# Altium schematic sheet REACTION-CIRCUIT-CONTROL.SchDoc
size A4
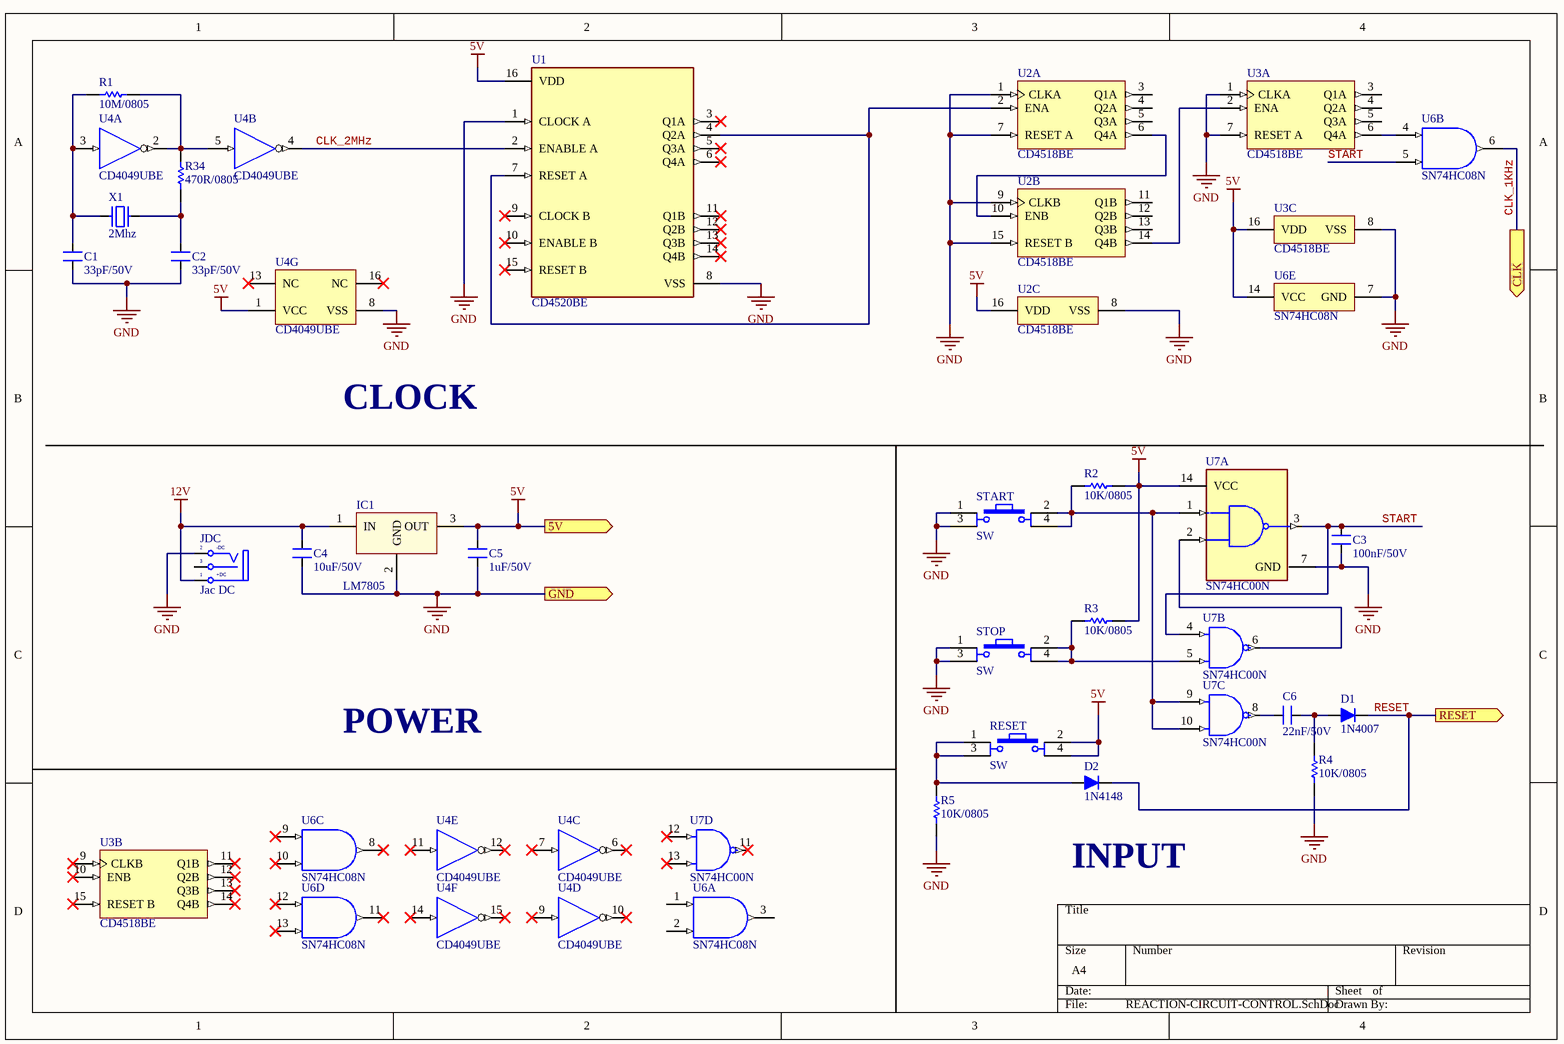
[diagram p0: REACTION-CIRCUIT-CONTROL.SchDoc]

## Parts
C1  33pF/50V  [Cap 0805(2012)]
C2  33pF/50V  [Cap 0805(2012)]
C3  100nF/50V  [Cap 0805(2012)]
C4  10uF/50V  [Cap 0805(2012)]
C5  1uF/50V  [Cap 0805(2012)]
C6  22nF/50V  [Cap 0805(2012)]
D1  1N4007  [1N4007]
D2  1N4148  [1N4007]
IC1  LM7805  [QTO-220H3]
JDC  Jac DC  [DC-IN]
R1  10M/0805  [Res 0805(2012)]
R2  10K/0805  [Res 0805(2012)]
R3  10K/0805  [Res 0805(2012)]
R4  10K/0805  [Res 0805(2012)]
R5  10K/0805  [Res 0805(2012)]
R34  470R/0805  [Res 0805(2012)]
RESET  SW  [SW4B]
START  SW  [SW4B]
STOP  SW  [SW4B]
U1  CD4520BE  [FP-N0016A-MFG]
U2  CD4518BE  [N0016A]  (parts A,B,C of 3)
U3  CD4518BE  [N0016A]  (parts A,B,C of 3)
U4  CD4049UBE  [N0016A]  (parts A,B,C,D,E,F,G of 7)
U6  SN74HC08N  [N0014A]  (parts A,B,C,D,E of 5)
U7  SN74HC00N  [FP-N0014A-MFG]  (parts A,B,C,D of 4)
X1  2Mhz  [XT2]

## Ports
5V (out), CLK (out), GND (out), RESET (out)

## Nets
5V: C5.2 IC1.3(OUT) R2.2 R3.2 RESET.2 RESET.4 U1.16(VDD) U2.16(VDD) U3.16(VDD) U4.1(VCC) U6.14(VCC) U7.14(VCC) ; port 5V
12V: C4.2 IC1.1(IN) JDC.1(T)
GND: C1.1 C2.1 C3.1 C4.1 C5.1 IC1.2(GND) JDC.2(TN) R4.2 R5.2 START.1 START.3 STOP.1 STOP.3 U1.1(CLOCK_A) U1.8(VSS) U2.1(CLKA) U2.7(RESET_A) U2.8(VSS) U2.9(CLKB) U2.15(RESET_B) U3.1(CLKA) U3.7(RESET_A) U3.8(VSS) U4.8(VSS) U6.7(GND) U7.7(GND) ; port GND
CLK_1KHz: U6.6(2Y) ; port CLK
CLK_2MHz: U1.2(ENABLE_A) U4.4(H=~{B})
RESET: D1.2(K) D2.2(K) ; port RESET
START: C3.2 U6.5(2B) U7.3(1Y) U7.4(2A)
NetC1_2: C1.2 R1.2 U4.3(A) X1.1
NetC2_2: C2.2 R34.2 X1.2
NetC6_1: C6.1 D1.1(A) R4.1
NetC6_2: C6.2 U7.8(3Y)
NetD2_1: D2.1(A) R5.1 RESET.1 RESET.3
NetR1_1: R1.1 R34.1 U4.2(G=~{A}) U4.5(B)
NetR2_1: R2.1 START.2 START.4 U7.1(1A) U7.9(3A) U7.10(3B)
NetR3_1: R3.1 STOP.2 STOP.4 U7.5(2B)
NetU1_4: U1.4(Q2A) U1.7(RESET_A) U2.2(ENA)
NetU2_6: U2.6(Q4A) U2.10(ENB)
NetU2_14: U2.14(Q4B) U3.2(ENA)
NetU3_6: U3.6(Q4A) U6.4(2A)
NetU7_2: U7.2(1B) U7.6(2Y)

Not connected (* = marked no-connect by the designer): JDC 3(S); U1 3(Q1A)* 5(Q3A)* 6(Q4A)* 9(CLOCK_B)* 10(ENABLE_B)* 11(Q1B)* 12(Q2B)* 13(Q3B)* 14(Q4B)* 15(RESET_B)*; U2 3(Q1A) 4(Q2A) 5(Q3A) 11(Q1B) 12(Q2B) 13(Q3B); U3 3(Q1A) 4(Q2A) 5(Q3A) 9(CLKB)* 10(ENB)* 11(Q1B)* 12(Q2B)* 13(Q3B)* 14(Q4B)* 15(RESET_B)*; U4 6(I=~{C})* 7(C)* 9(D)* 10(J=~{D})* 11(E)* 12(K=~{E})* 13(NC)* 14(F)* 15(L=~{F})* 16(NC)*; U6 1(1A) 2(1B) 3(1Y) 8(3Y)* 9(3A)* 10(3B)* 11(4Y)* 12(4A)* 13(4B)*; U7 11(4Y)* 12(4A)* 13(4B)*

## Notes on the sheet
- CLOCK
- POWER
- INPUT
- (in symbol DCIN) -DC; +DC

## Library data of the parts
C1-C6 = CAP_CER_1nF_50V_NPOL: Ceramic Capacitor 1nF/50V (+-20% TH)/(+10%SMD)
D1 D2 = 1N4007: Diode LS 1A 1000V DO-41
IC1 = LM78xx: On ap +, from + 5 to + 24VDC; Value: LM7805
JDC = DCIN: Jac DC input; Value: Jac DC
R1-R5 R34 = Resistor 0805
RESET START STOP = SW4: Switch button 4 pin; Value: Button chip 4 pin
U1 = CMP-1623-00555-3: IC DUAL BINARY UP COUNTER 16-DIP; Sync/Async: Synchronous; Power Dissipation: 500mW; Input Capacitance: 5pF; Frequency: 8MHz; Quiescent Current: 100uA; Min Supply Voltage: 3V; Turn-On Delay Time: 650ns; Number of Circuits: 2; Number of Bits: 4; Max Supply Voltage: 18V; Reset: Asynchronous; Logic Function: Counter; Package Quantity: 25; Min Operating Temperature: -55°C; Lead Free: Lead Free; Contact Plating: Gold; RoHS Compliant: Yes; Weight: 0.03357oz; Propagation Delay: 650ns; Number of Elements: 2; Radiation Hardening: No; Max Operating Temperature: 125°C; Mount: Through Hole; Case/Package: PDIP; Number of Pins: 16; REACH SVHC: No SVHC; Direction: Up; Packaging: Rail/Tube; Number of Bits per Element: 4
U2 U3 = CMP-1623-00558-2: CMOS Dual BCD Up-Counter, N0016A, TUBE; Manufacturer: Texas Instruments; Bits(#): 4; Schmitt Trigger: No; Inputs: 1; ICC @ Nom Voltage(Max)(mA): 0.03; Voltage(Nom)(V): 5,10,15; VCC(Min)(V): 3; VCC(Max)(V): 18; Technology Family: CD4000; F @ Nom Voltage(Max)(Mhz): 8; Output Drive (IOL/IOH)(Max)(mA): 1.5/-1.5; tpd @ Nom Voltage(Max)(ns): 230; Rating: Catalog; Output Type: CMOS; DatasheetVersion: SCHS076D; Generic Part Number: CD4518B; Type: Other; Function: Counter; Code_JEDEC: MS-001; Operating Temperature Range(C): -55 to 125; Input Type: CMOS; PackageReference: N0016A
U4 = CMP-1615-00914-2: CMOS Hex Inverting Buffer/Converter, N0016A, TUBE; Manufacturer: Texas Instruments; Rating: Military; Voltage(Nom)(V): 5; VCC(Min)(V): 3; VCC(Max)(V): 18; Output Drive (IOL/IOH)(Max)(mA): -1.2/5.2; ICC @ Nom Voltage(Max)(mA): 0.03; F @ Nom Voltage(Max)(Mhz): 12; tpd @ Nom Voltage(Max)(ns): 120; Technology Family: CD4000; Schmitt Trigger: No; Bits(#): 6; Code_JEDEC: MS-001; DatasheetVersion: SCHS046I; Generic Part Number: CD4049UB; Input Type: CMOS; Output Type: CMOS; PackageReference: N0016A; Operating Temperature Range(C): -55 to 125
U6 = CMP-0777-00250-3: Quadruple 2-Input Positive-AND Gates, N0014A, TUBE; Manufacturer: Texas Instruments; Output Type: CMOS; ICC @ Nom Voltage(Max)(mA): 0.02; tpd @ Nom Voltage(Max)(ns): 28; Voltage(Nom)(V): 5; VCC(Min)(V): 2; Technology Family: HC; F @ Nom Voltage(Max)(Mhz): 70; Rating: Catalog; Bits(#): 4; Schmitt Trigger: No; VCC(Max)(V): 6; PackageReference: N0014A; Input Type: CMOS; Generic Part Number: SN74HC08; DatasheetVersion: SCLS081F; Operating Temperature Range(C): -40 to 85
U7 = CMP-1627-00482-3: IC GATE NAND 4CH 2-INP 14DIP; Quiescent Current: 2uA; High Level Output Current: -5.2mA; Schmitt Trigger Input: No; Turn-On Delay Time: 20ns; Number of Input Lines: 2; Number of Elements: 4; Propagation Delay: 15ns; Low Level Output Current: 5.2mA; Operating Supply Voltage: 5V; Min Supply Voltage: 2V; Max Output Current: 4mA; Max Supply Voltage: 6V; Number of Outputs: 1; Width: 6.35mm; Case/Package: PDIP; Logic Function: NAND; Packaging: Rail/Tube; Number of Bits: 4; Weight: 0.032734oz; Mount: Through Hole; Length: 19.3mm; Contact Plating: Gold; Number of Inputs: 2; Radiation Hardening: No; Number of Pins: 14; Package Quantity: 25; Height: 4.57mm; Lead Free: Lead Free; Number of Circuits: 4; Output Current: 5.2mA; Min Operating Temperature: -40°C; REACH SVHC: No SVHC; Number of Output Lines: 1; Max Operating Temperature: 85°C; Number of Gates: 4
X1 = XT2: Crystal, 32.768 KHz, -40 to 85 degC, 3.2 x 1.5 x 0.9 mm SMD; Value: 4Mhz